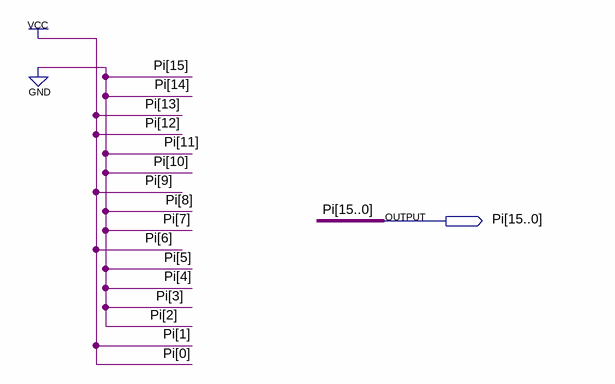
[diagram p0: schematic sheet]
// Quartus schematic Pi.bdf as structural Verilog: 0 symbols, 1 pins
module Pi (
  output [15:0] Pi
);


  assign Pi = 16'b0011001001000011;
endmodule
